# Altium schematic sheet USB.SchDoc
size Letter
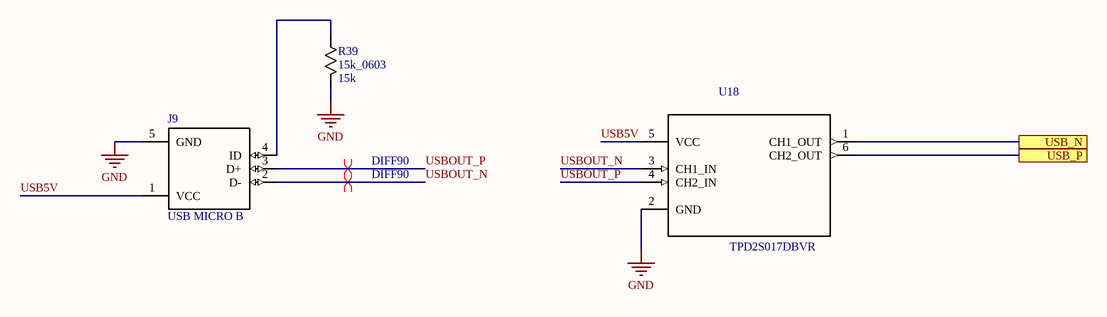
[diagram p0: USB.SchDoc]

## Parts
J9  USB MICRO B  [10103594-0001LF]
R39  15k_0603  Resistance: 15k  [0603]
U18  TPD2S017DBVR  [SOT95P280X145-6N]

## Ports
USB_N, USB_P

## Nets
GND: J9.5(GND) R39.1 U18.2(GND)
USB5V: J9.1(VCC) U18.5(VCC)
USB_N: U18.1(CH1_OUT) ; port USB_N
USB_P: U18.6(CH2_OUT) ; port USB_P
USBOUT_N: J9.2(D-) U18.3(CH1_IN)
USBOUT_P: J9.3(D+) U18.4(CH2_IN)
NetJ9_4: J9.4(ID) R39.2

## Layout directives
differential pair; differential pair class DIFF90; net class USBOCLASS: USBOUT_N, USBOUT_P

## Library data of the parts
J9 = 10103594-0001LF
R39 = 15k_0603: Manufacturer: Panasonic; Manufacturer Part Number: ERJ-3EKF1502V; Tolerance: 1%; Temperature Coefficient: 100ppm/°C; Max Power Dissipation: 100mW; Voltage Rating (DC): 75V; Supplier 1: Digi-Key; Stock 1: 0; Pricing 1: 5000=0.00751, 10000=0.00653, 25000=0.00573, 50000=0.00526, 125000=0.00515 (USD); Mount: Surface Mount; Case/Package: 0603; Number of Pins: 2; Case Code (Metric): 1608; Case Code (Imperial): 0603; Contact Plating: Tin; Min Operating Temperature: -55°C; Max Operating Temperature: 155°C; Packaging: Tape and Reel; Composition: Thick Film; Power Rating: 100mW; Number of Terminations: 2; Package Quantity: 1; Military Standard: Not; Termination: SMD/SMT; Voltage Rating: 75V; Length: 1.6mm; Height: 0.022inch; Width: 0.031inch; Depth: 0.8mm; Radiation Hardening: No; Lead Free: Lead Free; REACH SVHC: No SVHC; ComponentLink1URL: https://datasheet.ciiva.com/16770/70260748-16770997.pdf; ComponentLink1Description: https://datasheet.ciiva.com/16770/70260748-16770997.pdf; ComponentLink2URL: https://datasheet.ciiva.com/7830/426256-7830982.pdf; ComponentLink2Description: https://datasheet.ciiva.com/7830/426256-7830982.pdf; ComponentLink3URL: https://datasheet.ciiva.com/24026/aoa0000ce2-24026054.pdf; ComponentLink3Description: https://datasheet.ciiva.com/24026/aoa0000ce2-24026054.pdf; ComponentLink4URL: https://datasheet.ciiva.com/6138/aoa0000ce2-6138183.pdf; ComponentLink4Description: https://datasheet.ciiva.com/6138/aoa0000ce2-6138183.pdf; ComponentLink5URL: https://datasheet.ciiva.com/48530/aoa0000ce2-48530983.pdf; ComponentLink5Description: https://datasheet.ciiva.com/48530/aoa0000ce2-48530983.pdf; ComponentLink6URL: https://datasheet.ciiva.com/9193/aoa0000ce2-9193001.pdf; ComponentLink6Description: https://datasheet.ciiva.com/9193/aoa0000ce2-9193001.pdf; ComponentLink7URL: https://datasheet.ciiva.com/16762/70260748-16762729.pdf; ComponentLink7Description: https://datasheet.ciiva.com/16762/70260748-16762729.pdf; ComponentLink8URL: https://datasheet.ciiva.com/22722/426256-22722779.pdf; ComponentLink8Description: https://datasheet.ciiva.com/22722/426256-22722779.pdf; ComponentLink9URL: https://datasheet.ciiva.com/7830/aoa0000ce2-7830732.pdf; ComponentLink9Description: https://datasheet.ciiva.com/7830/aoa0000ce2-7830732.pdf; ComponentLink10URL: https://datasheet.ciiva.com/46372/1678782-46372846.pdf; ComponentLink10Description: https://datasheet.ciiva.com/46372/1678782-46372846.pdf; ComponentLink11URL: https://datasheet.ciiva.com/46372/1678782-46372847.pdf; ComponentLink11Description: https://datasheet.ciiva.com/46372/1678782-46372847.pdf; Supplier Part Number 1: P15.0KHTR-ND
U18 = TPD2S017DBVR: 2-Channel Ultra Low Clamp Voltage ESD Solution with Series-Resistor Isolation 6-SOT-23 -40 to 85; MF: Texas Instruments; Price: 0.32 USD; MP: TPD2S017DBVR; SnapEDA_Link: https://www.snapeda.com/parts/TPD2S017DBVR/Texas%20Instruments/view-part/?ref=snap; Availability: Good; Package: SOT-23-6 Texas Instruments; Value: *